# Altium schematic sheet Pack Disconnect MOSFETs.SchDoc
size A4; DocumentNumber: 3; SheetNumber: 3; SheetTotal: 4
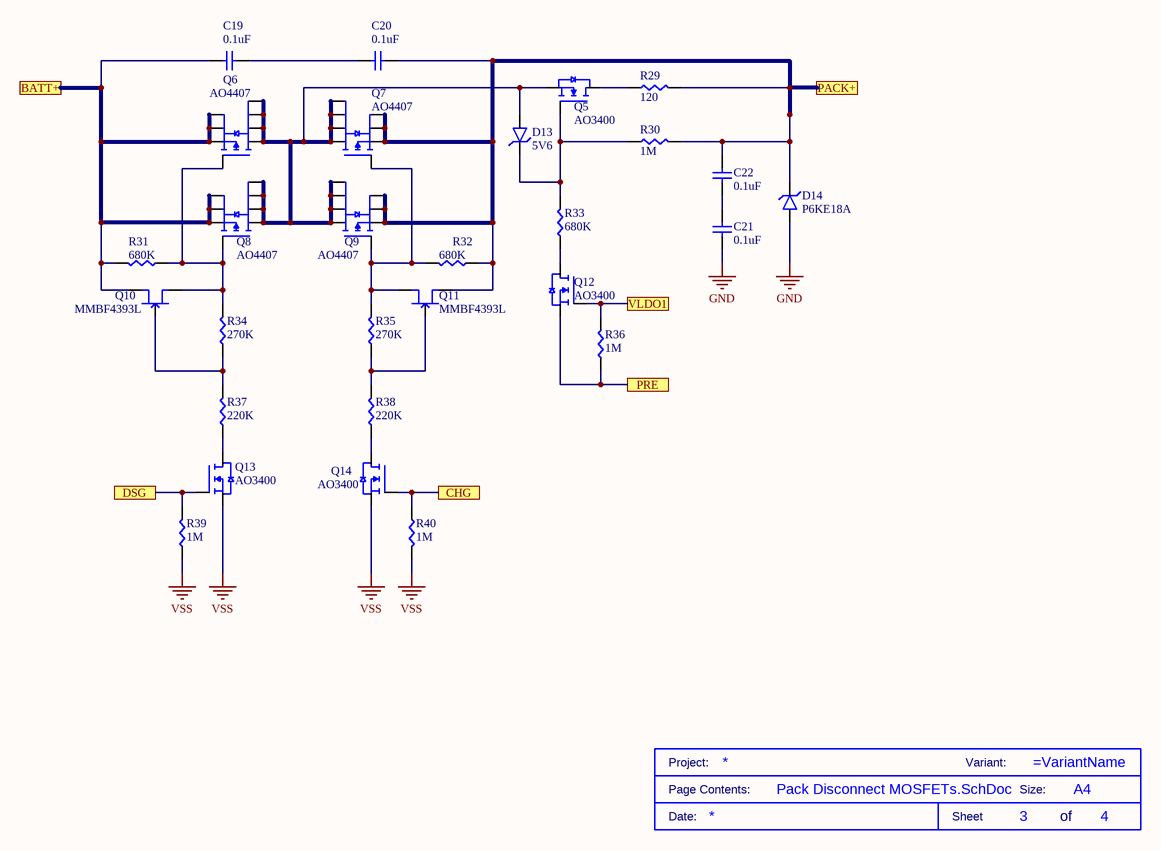
[diagram p0: Pack Disconnect MOSFETs.SchDoc]

## Parts
*  Size: A4  (hidden comment: TITLE BLOCK)  (graphical)
C19  0.1uF  [C0805]
C20  0.1uF  [C0805]
C21  0.1uF  [C0805]
C22  0.1uF  [C0805]
D13  5V6  [MiniMELF]
D14  P6KE18A  [DO-15]
Q5  AO3400  [SOT-23]
Q6  AO4407  [SOIC-8]
Q7  AO4407  [SOIC-8]
Q8  AO4407  [SOIC-8]
Q9  AO4407  [SOIC-8]
Q10  MMBF4393L  [SOT-23]
Q11  MMBF4393L  [SOT-23]
Q12  AO3400  [SOT-23]
Q13  AO3400  [SOT-23]
Q14  AO3400  [SOT-23]
R29  120  [RES TH 1W]
R30  1M  [R0805]
R31  680K  [R0805]
R32  680K  [R0805]
R33  680K  [R0805]
R34  270K  [R0805]
R35  270K  [R0805]
R36  1M  [R0805]
R37  220K  [R0805]
R38  220K  [R0805]
R39  1M  [R0805]
R40  1M  [R0805]

## Ports
BATT+, CHG, DSG, PACK+, PRE, VLDO1

## Nets
GND: C21.2 D14.1(A)
VSS: Q13.2(S) Q14.2(S) R39.1 R40.1
BATT+: C19.1 Q6.1(S) Q6.2(S) Q6.3(S) Q8.1(S) Q8.2(S) Q8.3(S) Q10.1(D) R31.2 ; port BATT+
CHG: Q14.1(G) R40.2 ; port CHG
DSG: Q13.1(G) R39.2 ; port DSG
PACK+: C20.2 C22.1 D14.2(K) Q7.1(S) Q7.2(S) Q7.3(S) Q9.1(S) Q9.2(S) Q9.3(S) Q11.1(D) R29.2 R30.2 R32.1 ; port PACK+
PRE: Q12.2(S) R36.1 ; port PRE
VLDO1: Q12.1(G) R36.2 ; port VLDO1
NetC19_2: C19.2 C20.1
NetC21_1: C21.1 C22.2
NetD13_1: D13.1(A) Q5.2(S) Q6.5(D) Q6.6(D) Q6.7(D) Q6.8(D) Q7.5(D) Q7.6(D) Q7.7(D) Q7.8(D) Q8.5(D) Q8.6(D) Q8.7(D) Q8.8(D) Q9.5(D) Q9.6(D) Q9.7(D) Q9.8(D)
NetD13_2: D13.2(K) Q5.1(G) R30.1 R33.2
NetQ5_3: Q5.3(D) R29.1
NetQ6_4: Q6.4(G) Q8.4(G) Q10.2(S) R31.1 R34.2
NetQ7_4: Q7.4(G) Q9.4(G) Q11.2(S) R32.2 R35.2
NetQ10_3: Q10.3(G) R34.1 R37.2
NetQ11_3: Q11.3(G) R35.1 R38.2
NetQ12_3: Q12.3(D) R33.1
NetQ13_3: Q13.3(D) R37.1
NetQ14_3: Q14.3(D) R38.1

## Notes on the sheet
- (in symbol TITLE BLOCK) Project:; Variant:; Page Contents:; Size:; Date:; Sheet; of

## Library data of the parts
C19-C22 = CAP 0805 0.1uF: Cap Ceramic 0.1uF 50V X7R 10% SMD 0805 125°C Paper T/R; Manufacturer: KEMET; Manufacturer Part Number: C0805C104K5RAC7411; Capacitance: 100nF; Supplier 1: Mouser; RoHS: Yes; Category: Ceramic Capacitors; Stock 1: 1204859; Pricing 1: 1=0,13000, 10=0,09300, 50=0,09300, 100=0,04400, 1000=0,02600, 10000=0,02100 (USD); Mount: Surface Mount; Case/Package: 0805; Dielectric Material: Ceramic; Min Operating Temperature: -55°C; Max Operating Temperature: 125°C; Packaging: Tape and Reel; Tolerance: 10%; Dielectric: X7R; Voltage Rating (DC): 50V; Construction: Flat; Length: 2mm; Height: 0.9mm; Depth: 1.25mm; Radiation Hardening: No; RoHS Compliant: Yes; ComponentLink1URL: http://components.arrow.com/part/dataview/30748302S8994022N7429?src-supplier=Arrow+Electronics; ComponentLink1Description: http://components.arrow.com/part/dataview/30748302S8994022N7429?src-supplier=Arrow+Electronics; ComponentLink2URL: https://www.verical.com/server-webapp/html/getDatasheet?partID=248513&src-supplier=Verical; ComponentLink2Description: https://www.verical.com/server-webapp/html/getDatasheet?partID=248513&src-supplier=Verical; Supplier Part Number 1: 80-C0805C104K5RACLR
D13 = ZENER 5V6: Diode Zener Single 5.6V 7% 500mW Automotive 2-Pin Mini-MELF T/R; Manufacturer: Diotec; Manufacturer Part Number: ZMM5.6; Tolerance: 5%; Supplier 1: Arrow Electronics; RoHS: Yes; Category: Zener Diodes; Stock 1: 11; Pricing 1: 1=0,10930, 10=0,02530 (USD); Case/Package: SOD; Zener Voltage: 5.6V; Power Dissipation: 500mW; RoHS Compliant: Yes; ComponentLink1URL: https://datasheet.ciiva.com/26309/rvzmm1-zmm75-data-e-26309545.pdf?src-supplier=Distrelec; ComponentLink1Description: https://datasheet.ciiva.com/26309/rvzmm1-zmm75-data-e-26309545.pdf?src-supplier=Distrelec; Supplier Part Number 1: ZMM5.6
D14 = P6KE18A: TVS DIODE 15.3VWM 32.5VC DO15; Manufacturer: Littelfuse; Clamping Voltage: 25.2V; Peak Pulse Power: 600W; Number of Unidirectional Channels: 1; Reverse Standoff Voltage: 15.3V; Min Breakdown Voltage: 17.1V; Power Line Protection: No; Peak Pulse Current: 24.2A; Max Surge Current: 24A; Polarity: Unidirectional; Test Current: 1mA; Leakage Current: 1uA; Voltage Rating (DC): 18V; Diode Type: ZENER; Max Breakdown Voltage: 18.9V; Max Power Dissipation: 5W; Supplier 1: Arrow Electronics; Manufacturer Part Number: P6KE18A; RoHS: Yes; Category: Diodes; Stock 1: 2982; Pricing 1: 1=0,51800, 10=0,42000, 25=0,41460, 100=0,29520, 250=0,29500, 500=0,23600, 1000=0,17410 (USD); Mount: Through Hole; Case/Package: DO-15; Number of Pins: 2; Min Operating Temperature: -55°C; Max Operating Temperature: 175°C; Packaging: Tape and Reel; Resistor Type: Zener; Package Quantity: 4000; Operating Supply Voltage: 15.3V; Reverse Breakdown Voltage: 17.1V; Breakdown Voltage: 17.1V; Number of Channels: 1; Termination: Axial; Number of Elements: 1; Series: P6KE; Direction: Unidirectional; Max Reverse Leakage Current: 1uA; Power Dissipation: 600W; Clamping Voltage-Max: 25.2V; Diameter: 3.6mm; Length: 7.6mm; Lead Free: Lead Free; RoHS Compliant: Yes; REACH SVHC: No SVHC; ComponentLink1URL: https://datasheet.ciiva.com/16473/littelfuse-tvs-diode-p6ke-16473576.pdf?src-supplier=Future+Electronics; ComponentLink1Description: https://datasheet.ciiva.com/16473/littelfuse-tvs-diode-p6ke-16473576.pdf?src-supplier=Future+Electronics; ComponentLink2URL: https://datasheet.ciiva.com/331/littelfuse-tvs-diode-p6ke-datasheet-pdf-331022.pdf?src-supplier=Digi-Key; ComponentLink2Description: https://datasheet.ciiva.com/331/littelfuse-tvs-diode-p6ke-datasheet-pdf-331022.pdf?src-supplier=Digi-Key; ComponentLink3URL: https://datasheet.ciiva.com/331/littelfuse-tvs-diode-p6ke-datasheet-pdf-331021.pdf?src-supplier=Digi-Key; ComponentLink3Description: https://datasheet.ciiva.com/331/littelfuse-tvs-diode-p6ke-datasheet-pdf-331021.pdf?src-supplier=Digi-Key; Supplier Part Number 1: P6KE18A
Q5 Q12-Q14 = AO3400: Trans MOSFET N-CH 30V 5.7A 3-Pin SOT-23; Manufacturer: Alpha & Omega Semiconductor; Manufacturer Part Number: AO3400A; Rds On Max: 26.5mR; Input Capacitance: 630pF; Max Power Dissipation: 1.4W; Number of Elements: 1; Gate to Source Voltage (Vgs): 12V; Supplier 1: TME; RoHS: Yes; Category: MOSFETs; Pricing 1: 10=0,07570, 50=0,06820, 250=0,06030, 1000=0,05410, 3000=0,05050 (EUR); Mount: Surface Mount; Case/Package: TO-236-3; Number of Pins: 3; Min Operating Temperature: -55°C; Max Operating Temperature: 150°C; Packaging: Tape and Reel; Series: -; Drain to Source Voltage (Vdss): 30V; Continuous Drain Current (ID): 5.7A; Power Dissipation: 1.4W; Radiation Hardening: No; RoHS Compliant: Yes; Lead Free: Lead Free; ComponentLink1URL: https://datasheet.ciiva.com/940/ao3400a-940739.pdf?src-supplier=Digi-Key; ComponentLink1Description: https://datasheet.ciiva.com/940/ao3400a-940739.pdf?src-supplier=Digi-Key; ComponentLink2URL: https://datasheet.ciiva.com/26906/getdatasheetpartid-64438-26906526.pdf?src-supplier=Verical; ComponentLink2Description: https://datasheet.ciiva.com/26906/getdatasheetpartid-64438-26906526.pdf?src-supplier=Verical; ComponentLink3URL: https://datasheet.ciiva.com/940/ao3400a-940740.pdf?src-supplier=Digi-Key; ComponentLink3Description: https://datasheet.ciiva.com/940/ao3400a-940740.pdf?src-supplier=Digi-Key; ComponentLink4URL: https://datasheet.ciiva.com/940/ao3400a-940741.pdf?src-supplier=Digi-Key; ComponentLink4Description: https://datasheet.ciiva.com/940/ao3400a-940741.pdf?src-supplier=Digi-Key; Supplier Part Number 1: AO3400A
Q6-Q9 = AO4407: MOSFET P-CH 30V 12A 8SOIC; Manufacturer: Alpha & Omega Semiconductor; Manufacturer Part Number: AO4407A; Rds On Max: 11mR; Input Capacitance: 2.6nF; Max Power Dissipation: 3.1W; Number of Elements: 1; Gate to Source Voltage (Vgs): 25V; ComponentLink1URL: https://media.digikey.com/pdf/Data%20Sheets/Alpha%20&amp;%20Omega/AO4407_Doc..pdf?src-supplier=Digi-Key; ComponentLink1Description: https://media.digikey.com/pdf/Data%20Sheets/Alpha%20&amp;%20Omega/AO4407_Doc..pdf?src-supplier=Digi-Key; Supplier 1: Arrow Electronics; RoHS: Yes; Category: MOSFETs; Stock 1: 3000; Pricing 1: 3000=0,93470, 6000=0,85170, 9000=0,75520, 15000=0,71280, 24000=0,62350, 30000=0,61730 (USD); Mount: Surface Mount; Case/Package: SOIC; Number of Pins: 8; Min Operating Temperature: -55°C; Max Operating Temperature: 150°C; Packaging: Tape and Reel; Drain to Source Voltage (Vdss): 30V; Continuous Drain Current (ID): 12A; Power Dissipation: 3.1W; Series: -; Radiation Hardening: No; Lead Free: Lead Free; RoHS Compliant: Yes; ComponentLink2URL: https://datasheet.ciiva.com/940/ao4407a-940836.pdf?src-supplier=Digi-Key; ComponentLink2Description: https://datasheet.ciiva.com/940/ao4407a-940836.pdf?src-supplier=Digi-Key; ComponentLink3URL: https://datasheet.ciiva.com/940/ao4407a-940838.pdf?src-supplier=Digi-Key; ComponentLink3Description: https://datasheet.ciiva.com/940/ao4407a-940838.pdf?src-supplier=Digi-Key; Supplier Part Number 1: AO4407A
Q10 Q11 = MMBF4393L: Trans Jfet N-ch 30V 3-PIN SOT-23 T/r; Manufacturer: ON Semiconductor; Manufacturer Part Number: MMBF4393LT3G; Input Capacitance: 14pF; Max Power Dissipation: 225mW; Element Configuration: Single; Polarity: N-CHANNEL; Supplier 1: Digi-Key; RoHS: Yes; Category: JFETs; Stock 1: 422; Pricing 1: 1=0,41000, 10=0,33600, 100=0,22840, 500=0,17134, 1000=0,12850, 2000=0,11780, 5000=0,11065 (USD); Mount: Surface Mount; Case/Package: SOT-23; Number of Pins: 3; Weight: 0.00709oz; Min Operating Temperature: -55°C; Max Operating Temperature: 150°C; Packaging: Tape and Reel; Package Quantity: 10000; Drain to Source Voltage (Vdss): 30V; Gate to Source Voltage (Vgs): 30V; Power Dissipation: 225mW; Breakdown Voltage: 30V; Series: -; Reach SVHC Compliant: Yes; Lead Free: Lead Free; Halogen Free: Halogen Free; RoHS Compliant: Yes; ComponentLink1URL: https://datasheet.ciiva.com/961/mmbf4391lt1-d-961042.pdf?src-supplier=Avnet; ComponentLink1Description: https://datasheet.ciiva.com/961/mmbf4391lt1-d-961042.pdf?src-supplier=Avnet; ComponentLink2URL: https://datasheet.ciiva.com/961/mmbf4391lt1-d-961129.pdf?src-supplier=Digi-Key; ComponentLink2Description: https://datasheet.ciiva.com/961/mmbf4391lt1-d-961129.pdf?src-supplier=Digi-Key; Supplier Part Number 1: MMBF4393LT3GOSCT-ND
R29 = RES TH 120 1W: Ultra Miniature Style Metal Film Resistor 120Ohm 1W 5% Axial T/R; Manufacturer: Yageo; Manufacturer Part Number: FMP100JR-52-120R; Resistance: 120R; Supplier 1: Arrow Electronics; RoHS: Yes; Category: Through-Hole Resistors; Stock 1: 18475; Pricing 1: 1=0,18070, 10=0,15020, 25=0,10430, 100=0,06410, 250=0,04920, 500=0,03870, 1000=0,02670, 3000=0,02540, 6000=0,02180, 15000=0,02010 (USD); Case/Package: Axial; Min Operating Temperature: -55°C; Max Operating Temperature: 155°C; Package Quantity: 1; Tolerance: 5%; Packaging: Tape and Reel; Number of Terminations: 2; Max Power Dissipation: 1W; Series: FMP; Resistor Type: Metal Film; Length: 0.248inch; Lead Free: Lead Free; RoHS Compliant: Yes; ComponentLink1URL: https://datasheet.ciiva.com/2710/yageolr-fmp-2013-2710614.pdf?src-supplier=Digi-Key; ComponentLink1Description: https://datasheet.ciiva.com/2710/yageolr-fmp-2013-2710614.pdf?src-supplier=Digi-Key; ComponentLink2URL: https://datasheet.ciiva.com/2710/yageolr-fmp-2013-2710613.pdf?src-supplier=Digi-Key; ComponentLink2Description: https://datasheet.ciiva.com/2710/yageolr-fmp-2013-2710613.pdf?src-supplier=Digi-Key; Supplier Part Number 1: FMP100JR-52-120R
R30 R36 R39 R40 = RES 0805 1M: Res Thick Film 0805 1M Ohm 5% 0.125W(1/8W) ±200ppm/°C Pad SMD T/R; Manufacturer: Vishay; Manufacturer Part Number: CRCW08051M00JNEAC; Supplier 1: Mouser; RoHS: No; Category: Chip SMD Resistors; Stock 1: 183; Pricing 1: 1=0,10000, 10=0,04000, 50=0,04000, 100=0,01700, 250=0,01600, 500=0,01500, 1000=0,00800, 2500=0,00700, 5000=0,00500, 10000=0,00500 (USD); Supplier Part Number 1: 71-CRCW08051M00JNEAC
R31-R33 = RES 0805 680K: Res Thick Film 0805 680K Ohm 5% 1/8W ±200ppm/°C Molded SMD SMD Paper T/R; Manufacturer: Vishay Dale; Manufacturer Part Number: CRCW0805680KJNEA; Resistance: 680kR; Power Rating: 125mW; Voltage Rating: 150V; Supplier 1: Digi-Key; RoHS: Yes; Category: Chip SMD Resistors; Stock 1: 65; Pricing 1: 1=0,10000, 10=0,04800, 100=0,01950, 1000=0,00874, 2500=0,00759 (USD); Case/Package: 0805; Number of Pins: 2; Weight: 0.000194oz; Case Code (Metric): 2012; Case Code (Imperial): 0805; Contact Plating: Tin; Size Code: 0805; Min Operating Temperature: -55°C; Max Operating Temperature: 155°C; Package Quantity: 1; Tolerance: 5%; Packaging: Tape and Reel; Resistor Type: Thick Film; Number of Terminations: 2; Temperature Coefficient: 200ppm/°C; Max Power Dissipation: 125mW; Voltage Rating (DC): 150V; Features: Automotive AEC-Q200; Series: CRCW; Resistance Tolerance: 5%; Construction: Rectangular; Length: 2mm; Width: 0.049inch; Height: 0.02inch; Depth: 1.25mm; Radiation Hardening: No; REACH SVHC: Unknown; Military Standard: Not; Lead Free: Lead Free; RoHS Compliant: Yes; ComponentLink1URL: https://datasheet.ciiva.com/2493/dcrcwe3-2493920.pdf?src-supplier=Digi-Key; ComponentLink1Description: https://datasheet.ciiva.com/2493/dcrcwe3-2493920.pdf?src-supplier=Digi-Key; ComponentLink2URL: https://datasheet.ciiva.com/2493/dcrcwe3-2493921.pdf?src-supplier=Digi-Key; ComponentLink2Description: https://datasheet.ciiva.com/2493/dcrcwe3-2493921.pdf?src-supplier=Digi-Key; ComponentLink3URL: https://datasheet.ciiva.com/5546/dcrcwe3-109170-5546277.pdf?src-supplier=Mouser; ComponentLink3Description: https://datasheet.ciiva.com/5546/dcrcwe3-109170-5546277.pdf?src-supplier=Mouser; ComponentLink4URL: https://datasheet.ciiva.com/8924/dcrcwe3-8924022.pdf?src-supplier=Avnet; ComponentLink4Description: https://datasheet.ciiva.com/8924/dcrcwe3-8924022.pdf?src-supplier=Avnet; ComponentLink5URL: https://datasheet.ciiva.com/2493/dcrcwe3-2493919.pdf?src-supplier=Digi-Key; ComponentLink5Description: https://datasheet.ciiva.com/2493/dcrcwe3-2493919.pdf?src-supplier=Digi-Key; Supplier Part Number 1: 541-680KACT-ND
R34 R35 = RES 0805 270K: Res Thick Film 0805 270K Ohm 5% 1/8W ±200ppm/°C Molded SMD SMD Paper T/R; Manufacturer: Vishay Dale; Manufacturer Part Number: CRCW0805270KJNEA; Resistance: 270kR; Power Rating: 125mW; Voltage Rating: 150V; Supplier 1: Arrow Electronics; RoHS: Yes; Category: Chip SMD Resistors; Stock 1: 4; Pricing 1: 1=0,04400 (USD); Case/Package: 0805; Number of Pins: 2; Weight: 0.000194oz; Case Code (Metric): 2012; Case Code (Imperial): 0805; Contact Plating: Tin; Size Code: 0805; Min Operating Temperature: -55°C; Max Operating Temperature: 155°C; Tolerance: 5%; Packaging: Tape and Reel; Package Quantity: 1; Resistor Type: Thick Film; Number of Terminations: 2; Termination: SMD/SMT; Temperature Coefficient: 200ppm/°C; Max Power Dissipation: 125mW; Voltage Rating (DC): 150V; Features: Automotive AEC-Q200; Series: CRCW; Construction: Rectangular; Resistance Tolerance: 5%; Length: 2mm; Width: 0.049inch; Height: 0.02inch; Depth: 1.25mm; Radiation Hardening: No; REACH SVHC: Unknown; Military Standard: Not; Lead Free: Lead Free; RoHS Compliant: Yes; ComponentLink1URL: https://datasheet.ciiva.com/2493/dcrcwe3-2493829.pdf?src-supplier=Digi-Key; ComponentLink1Description: https://datasheet.ciiva.com/2493/dcrcwe3-2493829.pdf?src-supplier=Digi-Key; ComponentLink2URL: https://datasheet.ciiva.com/2493/dcrcwe3-2493830.pdf?src-supplier=Digi-Key; ComponentLink2Description: https://datasheet.ciiva.com/2493/dcrcwe3-2493830.pdf?src-supplier=Digi-Key; ComponentLink3URL: https://datasheet.ciiva.com/2493/dcrcwe3-2493831.pdf?src-supplier=Digi-Key; ComponentLink3Description: https://datasheet.ciiva.com/2493/dcrcwe3-2493831.pdf?src-supplier=Digi-Key; ComponentLink4URL: https://datasheet.ciiva.com/3258/dcrcwe3-3258391.pdf?src-supplier=Avnet; ComponentLink4Description: https://datasheet.ciiva.com/3258/dcrcwe3-3258391.pdf?src-supplier=Avnet; ComponentLink5URL: https://datasheet.ciiva.com/5549/dcrcwe3-109170-5549770.pdf?src-supplier=Mouser; ComponentLink5Description: https://datasheet.ciiva.com/5549/dcrcwe3-109170-5549770.pdf?src-supplier=Mouser; ComponentLink6URL: https://datasheet.ciiva.com/16500/dcrcwe3-16500506.pdf?src-supplier=Future+Electronics; ComponentLink6Description: https://datasheet.ciiva.com/16500/dcrcwe3-16500506.pdf?src-supplier=Future+Electronics; Supplier Part Number 1: CRCW0805270KJNEA
R37 R38 = RES 0805 220K: Res Thick Film 0805 220K Ohm 5% 1/8W ±200ppm/°C Molded SMD SMD Paper T/R; Manufacturer: Vishay Dale; Manufacturer Part Number: CRCW0805220KJNEA; Resistance: 220kR; Power Rating: 125mW; Voltage Rating: 150V; Supplier 1: Arrow Electronics; RoHS: Yes; Category: Chip SMD Resistors; Stock 1: 277; Pricing 1: 1=0,05510, 10=0,03660, 25=0,03490, 50=0,03450, 100=0,02070, 250=0,01310 (USD); Mount: Surface Mount; Case/Package: 0805; Weight: 0.000194oz; Case Code (Metric): 2012; Case Code (Imperial): 0805; Contact Plating: Tin; Size Code: 0805; Min Operating Temperature: -55°C; Max Operating Temperature: 155°C; Package Quantity: 1; Tolerance: 5%; Packaging: Tape and Reel; Resistor Type: Thick Film; Number of Terminations: 2; Termination: SMD/SMT; Temperature Coefficient: 200ppm/°C; Max Power Dissipation: 125mW; Voltage Rating (DC): 150V; Features: Automotive AEC-Q200; Series: CRCW; Construction: Rectangular; Resistance Tolerance: 5%; Length: 2mm; Width: 0.049inch; Height: 0.02inch; Depth: 1.25mm; Radiation Hardening: No; REACH SVHC: Unknown; Military Standard: Not; Lead Free: Lead Free; RoHS Compliant: Yes; ComponentLink1URL: https://datasheet.ciiva.com/2464/dcrcwe3-2464864.pdf?src-supplier=Digi-Key; ComponentLink1Description: https://datasheet.ciiva.com/2464/dcrcwe3-2464864.pdf?src-supplier=Digi-Key; ComponentLink2URL: https://datasheet.ciiva.com/2464/dcrcwe3-2464865.pdf?src-supplier=Digi-Key; ComponentLink2Description: https://datasheet.ciiva.com/2464/dcrcwe3-2464865.pdf?src-supplier=Digi-Key; ComponentLink3URL: https://datasheet.ciiva.com/2464/dcrcwe3-2464866.pdf?src-supplier=Digi-Key; ComponentLink3Description: https://datasheet.ciiva.com/2464/dcrcwe3-2464866.pdf?src-supplier=Digi-Key; ComponentLink4URL: https://datasheet.ciiva.com/3258/dcrcwe3-3258325.pdf?src-supplier=Avnet; ComponentLink4Description: https://datasheet.ciiva.com/3258/dcrcwe3-3258325.pdf?src-supplier=Avnet; ComponentLink5URL: https://datasheet.ciiva.com/28606/1747939-28606759.pdf?src-supplier=Element14; ComponentLink5Description: https://datasheet.ciiva.com/28606/1747939-28606759.pdf?src-supplier=Element14; ComponentLink6URL: https://datasheet.ciiva.com/16498/dcrcw-16498286.pdf?src-supplier=Future+Electronics; ComponentLink6Description: https://datasheet.ciiva.com/16498/dcrcw-16498286.pdf?src-supplier=Future+Electronics; Supplier Part Number 1: CRCW0805220KJNEA